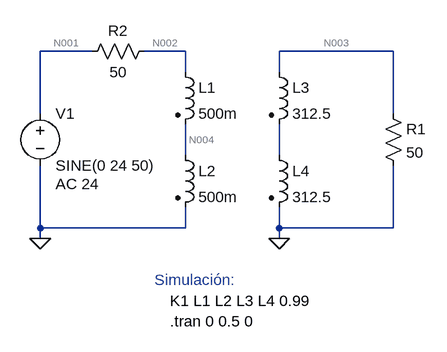
[diagram p0: schematic TPT5 - Configuración del Transformador.asc]
TPT5 - Configuración del Transformador.asc, the LTspice schematic file:
Version 4
SHEET 1 880 680
WIRE -16 16 -96 16
WIRE 128 16 64 16
WIRE 448 16 272 16
WIRE 128 48 128 16
WIRE 272 48 272 16
WIRE -96 112 -96 16
WIRE 448 112 448 16
WIRE 128 176 128 128
WIRE 272 176 272 128
WIRE -96 288 -96 192
WIRE 128 288 128 256
WIRE 128 288 -96 288
WIRE 272 288 272 256
WIRE 448 288 448 192
WIRE 448 288 272 288
WIRE -96 304 -96 288
WIRE 272 304 272 288
FLAG -96 304 0
FLAG 272 304 0
SYMBOL voltage -96 96 R0
WINDOW 123 24 124 Left 2
WINDOW 39 0 0 Left 0
SYMATTR Value2 AC 24
SYMATTR InstName V1
SYMATTR Value SINE(0 24 50)
SYMBOL res 432 96 R0
SYMATTR InstName R1
SYMATTR Value 50
SYMBOL ind2 112 32 R0
SYMATTR InstName L1
SYMATTR Value 500m
SYMATTR Type ind
SYMBOL ind2 112 160 R0
SYMATTR InstName L2
SYMATTR Value 500m
SYMATTR Type ind
SYMBOL ind2 256 32 R0
SYMATTR InstName L3
SYMATTR Value 312.5
SYMATTR Type ind
SYMBOL ind2 256 160 R0
SYMATTR InstName L4
SYMATTR Value 312.5
SYMATTR Type ind
SYMBOL res -32 32 R270
WINDOW 0 32 56 VTop 2
WINDOW 3 0 56 VBottom 2
SYMATTR InstName R2
SYMATTR Value 50
TEXT 104 400 Left 2 !K1 L1 L2 L3 L4 0.99
TEXT 80 368 Left 2 ;Simulación:
TEXT 104 432 Left 2 !.tran 0 0.5 0

The netlist it stands for:
* TPT5 - Configuración del Transformador.asc
V1 N001 0 SINE(0 24 50) AC 24
R1 N003 0 50
L1 N002 N004 500m
L2 N004 0 500m
L3 N003 N005 312.5
L4 N005 0 312.5
R2 N001 N002 50
K1 L1 L2 L3 L4 0.99
* Simulación:
.tran 0 0.5 0
.backanno
.end

* Results of the author's LTspice run, read from the files saved beside the schematic
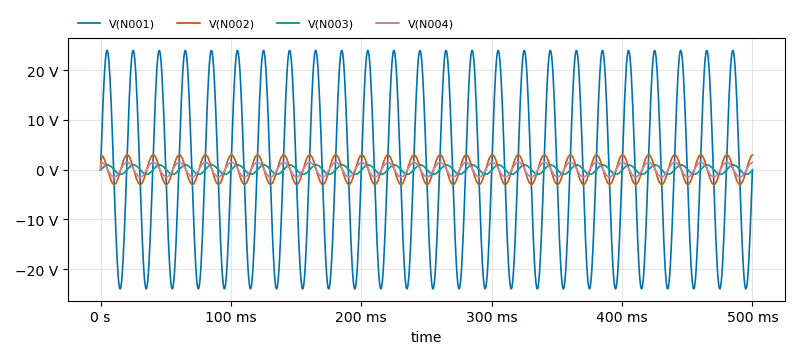
[diagram p1: Transient Analysis of TPT5 - Configuración del Transformador.asc, plotted from the saved traces]
* Transient Analysis, 1 run:
*   V(N001): min -23.96 V, max 23.99 V, average 13.31 µV, rms 16.97 V, last 0 V
*   V(N002): min -2.967 V, max 2.967 V, average -2.444 mV, rms 2.096 V, last 2.957 V
*   V(N003): min -940.8 mV, max 941.4 mV, average -21.23 µV, rms 665.6 mV, last -117.7 mV
*   V(N004): min -1.484 V, max 1.484 V, average -1.222 mV, rms 1.048 V, last 1.479 V